# Altium schematic sheet STLINK.SchDoc
size A4; SheetNumber: 6; SheetTotal: 9
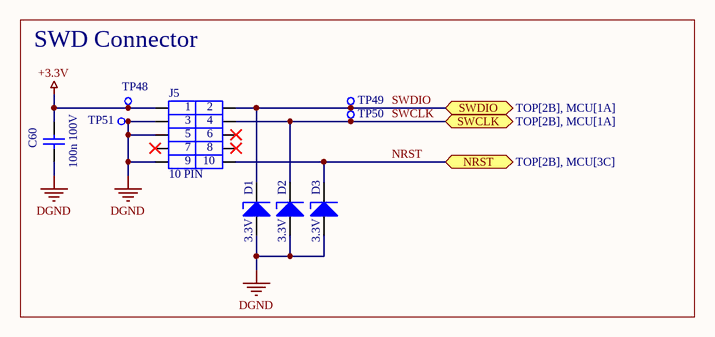
[diagram p0: STLINK.SchDoc]

## Parts
C60  100n 100V  [CAPACITOR 0805]
D1  3.3V  [DIODE SOD523F]
D2  3.3V  [DIODE SOD523F]
D3  3.3V  [DIODE SOD523F]
J5  10 PIN  [MECHANICAL PINHEADER 2x5P 1.27MM MALE]
TP48  1mm  [TEST POINT 1MM]  (value not drawn)
TP49  1mm  [TEST POINT 1MM]  (value not drawn)
TP50  1mm  [TEST POINT 1MM]  (value not drawn)
TP51  1mm  [TEST POINT 1MM]  (value not drawn)

## Blocks framed on the sheet
SWD Connector: C60 D1-D3 J5 TP48-TP51

## Ports
NRST (bidir, see TOP[2B], MCU[3C]), SWCLK (bidir, see TOP[2B], MCU[1A]), SWDIO (bidir, see TOP[2B], MCU[1A])

## Nets
+3.3V: C60.2 J5.1 TP48.1
DGND: C60.1 D1.1 D2.1 D3.1 J5.3 J5.5 J5.9 TP51.1
NRST: D3.2 J5.10 ; port NRST
SWCLK: D2.2 J5.4 TP50.1 ; port SWCLK
SWDIO: D1.2 J5.2 TP49.1 ; port SWDIO

Not connected (* = marked no-connect by the designer): J5 6* 7* 8*

## Library data of the parts
C60 = Capacitor 100n 100V 10% X7R 0805: Capacitor: ceramic; MLCC; 100nF; 100V; X7R; ±10%; SMD; 0805; Manufacturer: YAGEO; Manufacturer Part Number: CC0805KKX7R0BB104; ComponentLink1Description: Datasheet; ComponentLink1URL: https://www.tme.eu/Document/fbb9415081fcefba62c0f8bbf5b21210/UPY-GPHC_X7R_6.3V-to-50V_20.pdf; Footprint: Capacitor 0805; Price 10pcs [$]: 0.0770; Supplier: TME
D1-D3 = Diode TVS 3.3V Unidirectional ESD5Z3V3: Diode: TVS; 134W; 5V; 11.2A; unidirectional; SOD523F; reel,tape; Manufacturer: DIOTEC SEMICONDUCTOR; Manufacturer Part Number: ESD5Z3V3; Price 10pcs [$]: 0.0484; Supplier: TME; ComponentLink1Description: Datasheet; ComponentLink1URL: https://www.tme.eu/Document/ce6dc2b16f15e75cb22a06d57779cb3c/esd5z2v5.pdf
J5 = Mechanical Pinheader Male 2x5pin P=1.27mm THT: Pin header; pin strips; male; PIN: 10; straight; 1.27mm; THT; 2x5; Manufacturer: CONNFLY; Manufacturer Part Number: DS1031-06-2*5P8BV41-3A; ComponentLink1Description: Datasheet; ComponentLink1URL: https://www.tme.eu/Document/a3f73054ce53c2beb96c95af7253a843/DS1031-06.pdf; Price 10pcs [$]: 0.430; Supplier: TME
TP48-TP51 = Mechanical Test Point 1mm: Tesp Point 1mm; ComponentLink1Description: Datasheet; ComponentLink1URL: -; Manufacturer: -; Manufacturer Part Number: -; Footprint: -; Price 10pcs [$]: -; Supplier: -